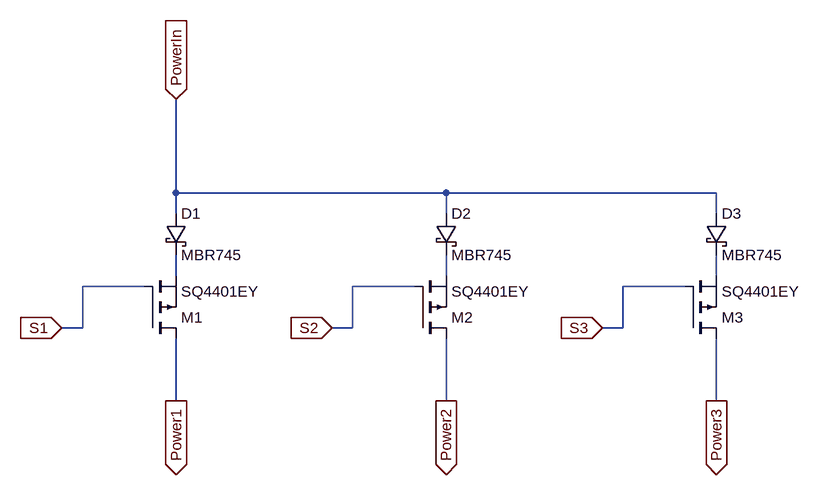
[diagram p0: schematic powerswitch.asc]
powerswitch.asc, the LTspice schematic file:
Version 4
SHEET 1 1452 724
WIRE 480 -272 480 -416
WIRE 896 -272 480 -272
WIRE 1312 -272 896 -272
WIRE 480 -240 480 -272
WIRE 896 -240 896 -272
WIRE 1312 -240 1312 -272
WIRE 480 -144 480 -176
WIRE 896 -144 896 -176
WIRE 1312 -144 1312 -176
WIRE 432 -128 336 -128
WIRE 848 -128 752 -128
WIRE 1264 -128 1168 -128
WIRE 336 -64 336 -128
WIRE 336 -64 304 -64
WIRE 752 -64 752 -128
WIRE 752 -64 720 -64
WIRE 1168 -64 1168 -128
WIRE 1168 -64 1136 -64
WIRE 480 48 480 -48
WIRE 896 48 896 -48
WIRE 1312 48 1312 -48
FLAG 304 -64 S1
IOPIN 304 -64 In
FLAG 480 -416 PowerIn
IOPIN 480 -416 In
FLAG 480 48 Power1
IOPIN 480 48 Out
FLAG 720 -64 S2
IOPIN 720 -64 In
FLAG 896 48 Power2
IOPIN 896 48 Out
FLAG 1136 -64 S3
IOPIN 1136 -64 In
FLAG 1312 48 Power3
IOPIN 1312 48 Out
SYMBOL pmos 432 -48 M180
SYMATTR InstName M1
SYMATTR Value SQ4401EY
SYMBOL schottky 464 -240 R0
SYMATTR InstName D1
SYMATTR Value MBR745
SYMATTR Description Diode
SYMATTR Type diode
SYMBOL pmos 848 -48 M180
SYMATTR InstName M2
SYMATTR Value SQ4401EY
SYMBOL schottky 880 -240 R0
SYMATTR InstName D2
SYMATTR Value MBR745
SYMATTR Description Diode
SYMATTR Type diode
SYMBOL pmos 1264 -48 M180
SYMATTR InstName M3
SYMATTR Value SQ4401EY
SYMBOL schottky 1296 -240 R0
SYMATTR InstName D3
SYMATTR Value MBR745
SYMATTR Description Diode
SYMATTR Type diode

The netlist it stands for:
* powerswitch.asc
M1 Power1 S1 N001 N001 SQ4401EY
D1 PowerIn N001 MBR745
M2 Power2 S2 N002 N002 SQ4401EY
D2 PowerIn N002 MBR745
M3 Power3 S3 N003 N003 SQ4401EY
D3 PowerIn N003 MBR745
.model D D
.lib standard.dio
.model NMOS NMOS
.model PMOS PMOS
.lib standard.mos
.backanno
.end